# Altium schematic sheet FPGA.SchDoc: MEGAPHONE FPGA
size A3; SheetNumber: 2
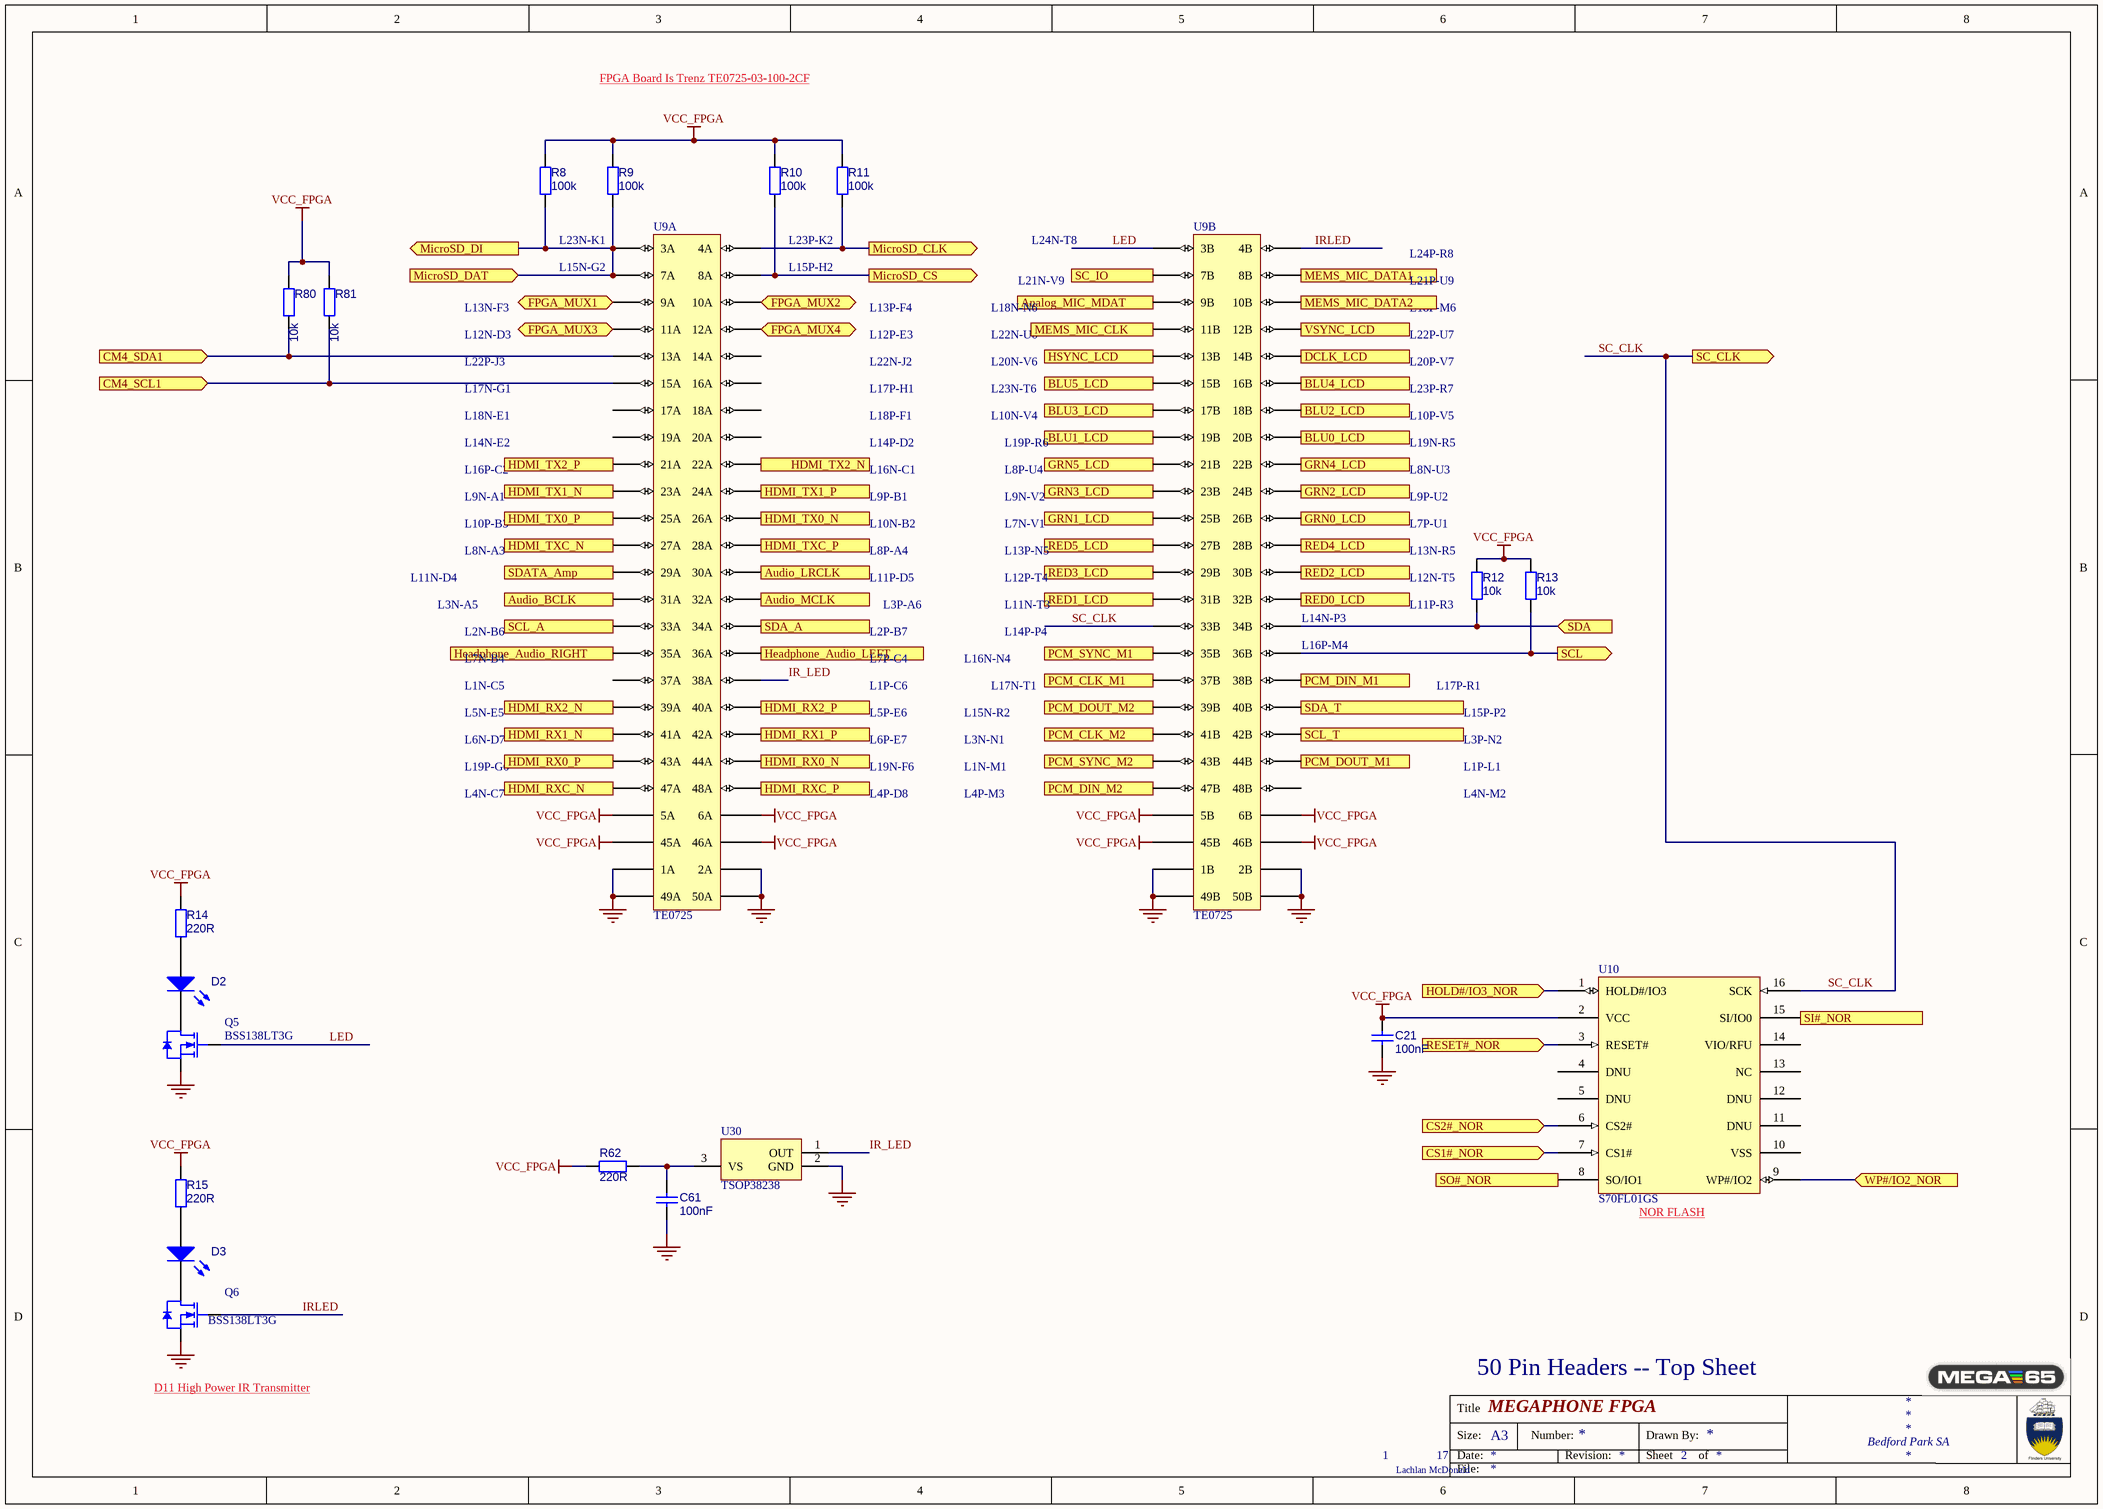
[diagram p0: FPGA.SchDoc]

## Parts
C21  100nF  [0603_CAP UF HD]
C61  100nF  [0603_CAP UF HD]
D2  (no value)  [LED 3mm Red]
D3  (no value)  [LED 3mm Red]
Q5  BSS138LT3G  [SOT-23]
Q6  BSS138LT3G  [SOT-23]
R8  100k  [0603-RESISTOR HD]
R9  100k  [0603-RESISTOR HD]
R10  100k  [0603-RESISTOR HD]
R11  100k  [0603-RESISTOR HD]
R12  10k  [0603-RESISTOR HD]
R13  10k  [0603-RESISTOR HD]
R14  220R  [0603-RESISTOR HD]
R15  220R  [0603-RESISTOR HD]
R62  220R  [0603-RESISTOR HD]
R80  10k  [0603-RESISTOR HD]
R81  10k  [0603-RESISTOR HD]
U9  TE0725  [Trenz TE-0725]  (parts A,B of 2)
U10  S70FL01GS  [S70FL01GS]
U30  TSOP38238  [VISH-TSOP38238]

## Ports
Analog_MIC_MDAT (in), Audio_BCLK (out), Audio_LRCLK (out), Audio_MCLK (out), BLU0_LCD (out), BLU1_LCD (out), BLU2_LCD (out), BLU3_LCD (out), BLU4_LCD (out), BLU5_LCD (out), CM4_SCL1 (in), CM4_SDA1 (in), CS1#_NOR (in), CS2#_NOR (in), DCLK_LCD (out), FPGA_MUX1 (bidir), FPGA_MUX2 (bidir), FPGA_MUX3 (bidir), FPGA_MUX4 (bidir), GRN0_LCD (out), GRN1_LCD (out), GRN2_LCD (out), GRN3_LCD (out), GRN4_LCD (out), GRN5_LCD (out), HDMI_RX0_N (in), HDMI_RX0_P (in), HDMI_RX1_N (in), HDMI_RX1_P (in), HDMI_RX2_N (in), HDMI_RX2_P (in), HDMI_RXC_N (in), HDMI_RXC_P (in), HDMI_TX0_N (out), HDMI_TX0_P (out), HDMI_TX1_N (out), HDMI_TX1_P (out), HDMI_TX2_N (out), HDMI_TX2_P (out), HDMI_TXC_N (out), HDMI_TXC_P (out), Headphone_Audio_LEFT (out), Headphone_Audio_RIGHT (out), HOLD#/IO3_NOR (in), HSYNC_LCD (out), MEMS_MIC_CLK (out), MEMS_MIC_DATA1 (in), MEMS_MIC_DATA2 (in), MicroSD_CLK (out), MicroSD_CS (out), MicroSD_DAT (in), MicroSD_DI (out), PCM_CLK_M1 (out), PCM_CLK_M2 (out), PCM_DIN_M1 (out), PCM_DIN_M2 (out), PCM_DOUT_M1 (in), PCM_DOUT_M2 (in), PCM_SYNC_M1 (in), PCM_SYNC_M2 (in), RED0_LCD (out), RED1_LCD (out), RED2_LCD (out), RED3_LCD (out), RED4_LCD (out), RED5_LCD (out), RESET#_NOR (in), SC_CLK (out), SC_IO (in), SCL (out), SCL_A (out), SCL_T (out), SDA (in), SDA_A (out), SDA_T (in), SDATA_Amp (out), SI#_NOR (in), SO#_NOR (out), VSYNC_LCD (out), WP#/IO2_NOR (in)

## Nets
GND: C21.2 C61.2 Q5.2(S) Q6.2(S) U9.1A U9.1B U9.2A U9.2B U9.49A U9.49B U9.50A U9.50B U30.2(GND)
VCC_FPGA: C21.1 R8.1 R9.1 R10.1 R11.1 R12.1 R13.1 R14.1 R15.1 R62.1 R80.1 R81.1 U9.5A U9.5B U9.6A U9.6B U9.45A U9.45B U9.46A U9.46B U10.2(VCC)
Analog_MIC_MDAT: U9.9B ; port Analog_MIC_MDAT
Audio_BCLK: U9.31A ; port Audio_BCLK
Audio_LRCLK: U9.30A ; port Audio_LRCLK
Audio_MCLK: U9.32A ; port Audio_MCLK
BLU0_LCD: U9.20B ; port BLU0_LCD
BLU1_LCD: U9.19B ; port BLU1_LCD
BLU2_LCD: U9.18B ; port BLU2_LCD
BLU3_LCD: U9.17B ; port BLU3_LCD
BLU4_LCD: U9.16B ; port BLU4_LCD
BLU5_LCD: U9.15B ; port BLU5_LCD
CM4_SCL1: R81.2 U9.15A ; port CM4_SCL1
CM4_SDA1: R80.2 U9.13A ; port CM4_SDA1
CS1#_NOR: U10.7(CS1#) ; port CS1#_NOR
CS2#_NOR: U10.6(CS2#) ; port CS2#_NOR
DCLK_LCD: U9.14B ; port DCLK_LCD
FPGA_MUX1: U9.9A ; port FPGA_MUX1
FPGA_MUX2: U9.10A ; port FPGA_MUX2
FPGA_MUX3: U9.11A ; port FPGA_MUX3
FPGA_MUX4: U9.12A ; port FPGA_MUX4
GRN0_LCD: U9.26B ; port GRN0_LCD
GRN1_LCD: U9.25B ; port GRN1_LCD
GRN2_LCD: U9.24B ; port GRN2_LCD
GRN3_LCD: U9.23B ; port GRN3_LCD
GRN4_LCD: U9.22B ; port GRN4_LCD
GRN5_LCD: U9.21B ; port GRN5_LCD
HDMI_RX0_N: U9.44A ; port HDMI_RX0_N
HDMI_RX0_P: U9.43A ; port HDMI_RX0_P
HDMI_RX1_N: U9.41A ; port HDMI_RX1_N
HDMI_RX1_P: U9.42A ; port HDMI_RX1_P
HDMI_RX2_N: U9.39A ; port HDMI_RX2_N
HDMI_RX2_P: U9.40A ; port HDMI_RX2_P
HDMI_RXC_N: U9.47A ; port HDMI_RXC_N
HDMI_RXC_P: U9.48A ; port HDMI_RXC_P
HDMI_TX0_N: U9.26A ; port HDMI_TX0_N
HDMI_TX0_P: U9.25A ; port HDMI_TX0_P
HDMI_TX1_N: U9.23A ; port HDMI_TX1_N
HDMI_TX1_P: U9.24A ; port HDMI_TX1_P
HDMI_TX2_N: U9.22A ; port HDMI_TX2_N
HDMI_TX2_P: U9.21A ; port HDMI_TX2_P
HDMI_TXC_N: U9.27A ; port HDMI_TXC_N
HDMI_TXC_P: U9.28A ; port HDMI_TXC_P
Headphone_Audio_LEFT: U9.36A ; port Headphone_Audio_LEFT
Headphone_Audio_RIGHT: U9.35A ; port Headphone_Audio_RIGHT
HOLD#/IO3_NOR: U10.1(HOLD#/IO3) ; port HOLD#/IO3_NOR
HSYNC_LCD: U9.13B ; port HSYNC_LCD
IR_LED: U9.38A U30.1(OUT)
IRLED: Q6.1(G) U9.4B
LED: Q5.1(G) U9.3B
MEMS_MIC_CLK: U9.11B ; port MEMS_MIC_CLK
MEMS_MIC_DATA1: U9.8B ; port MEMS_MIC_DATA1
MEMS_MIC_DATA2: U9.10B ; port MEMS_MIC_DATA2
MicroSD_CLK: R11.2 U9.4A ; port MicroSD_CLK
MicroSD_CS: R10.2 U9.8A ; port MicroSD_CS
MicroSD_DAT: R8.2 R9.2 U9.3A U9.7A ; port MicroSD_DAT, port MicroSD_DI
PCM_CLK_M1: U9.37B ; port PCM_CLK_M1
PCM_CLK_M2: U9.41B ; port PCM_CLK_M2
PCM_DIN_M1: U9.38B ; port PCM_DIN_M1
PCM_DIN_M2: U9.47B ; port PCM_DIN_M2
PCM_DOUT_M1: U9.44B ; port PCM_DOUT_M1
PCM_DOUT_M2: U9.39B ; port PCM_DOUT_M2
PCM_SYNC_M1: U9.35B ; port PCM_SYNC_M1
PCM_SYNC_M2: U9.43B ; port PCM_SYNC_M2
RED0_LCD: U9.32B ; port RED0_LCD
RED1_LCD: U9.31B ; port RED1_LCD
RED2_LCD: U9.30B ; port RED2_LCD
RED3_LCD: U9.29B ; port RED3_LCD
RED4_LCD: U9.28B ; port RED4_LCD
RED5_LCD: U9.27B ; port RED5_LCD
RESET#_NOR: U10.3(RESET#) ; port RESET#_NOR
SC_CLK: U9.33B U10.16(SCK) ; port SC_CLK
SC_IO: U9.7B ; port SC_IO
SCL: R13.2 U9.36B ; port SCL
SCL_A: U9.33A ; port SCL_A
SCL_T: U9.42B ; port SCL_T
SDA: R12.2 U9.34B ; port SDA
SDA_A: U9.34A ; port SDA_A
SDA_T: U9.40B ; port SDA_T
SDATA_Amp: U9.29A ; port SDATA_Amp
SI#_NOR: U10.15(SI/IO0) ; port SI#_NOR
SO#_NOR: U10.8(SO/IO1) ; port SO#_NOR
VSYNC_LCD: U9.12B ; port VSYNC_LCD
WP#/IO2_NOR: U10.9(WP#/IO2) ; port WP#/IO2_NOR
NetC61_1: C61.1 R62.2 U30.3(VS)
NetD2_A: D2.A R14.2
NetD2_K: D2.K Q5.3(D)
NetD3_A: D3.A R15.2
NetD3_K: D3.K Q6.3(D)

Not connected (* = marked no-connect by the designer): U9 14A 16A 17A 18A 19A 20A 37A 48B; U10 4(DNU) 5(DNU) 10(VSS) 11(DNU) 12(DNU) 13(NC) 14(VIO/RFU)

## Notes on the sheet
- FPGA Board Is Trenz TE0725-03-100-2CF
- L23N-K1
- L23P-K2
- L24N-T8
- L13N-F3
- L15N-G2
- L15P-H2
- L13P-F4
- L18N-N6
- L21N-V9
- L24P-R8
- L21P-U9
- L18P-M6
- L12N-D3
- L22P-J3
- L12P-E3
- L22N-J2
- L22N-U6
- L20N-V6
- L22P-U7
- L20P-V7
- L17N-G1
- L18N-E1
- L14N-E2
- L17P-H1
- L18P-F1
- L14P-D2
- L23N-T6
- L10N-V4
- L19P-R6
- L23P-R7
- L10P-V5
- L19N-R5
- L16P-C2
- L9N-A1
- L16N-C1
- L9P-B1
- L8P-U4
- L9N-V2
- L8N-U3
- L9P-U2
- L11N-D4
- L10P-B3
- L8N-A3
- L10N-B2
- L8P-A4
- L11P-D5
- L7N-V1
- L13P-N5
- L12P-T4
- (near R12) L7P-U1
- (near R12) L13N-R5
- (near R12) L12N-T5
- L3N-A5
- L2N-B6
- L2P-B7
- L3P-A6
- L11N-T3
- L14P-P4
- (near U9) L14N-P3
- (near U9) L16P-M4
- (near R12) L11P-R3
- L7N-B4
- L1N-C5
- L5N-E5
- L7P-C4
- L1P-C6
- L5P-E6
- L16N-N4
- L15N-R2
- L17N-T1
- L17P-R1
- L15P-P2
- L6N-D7
- L19P-G6
- L6P-E7
- L19N-F6
- L3N-N1
- L1N-M1
- L3P-N2
- L1P-L1
- L4N-C7
- L4P-D8
- L4P-M3
- L4N-M2
- (near U10) NOR FLASH
- D11 High Power IR Transmitter
- 50 Pin Headers -- Top Sheet
- 1
- 17
- Lachlan McDonald
- Title
- Size:
- Date:
- A3
- Number:
- Revision:
- Sheet
- Drawn By:
- of
- Bedford Park SA
- File:

## Library data of the parts
C21 C61 = Cap: Capacitor; Value: 100nF
D2 D3 = LED: Manufacturer: *; Element 14 Part Number: *
Q5 Q6 = BSS138LT3G: Power MOSFET, 200 mA, 50 V, N-Channel, 3-Pin SOT-23, Pb-Free, Tape and Reel; Manufacturer: On Semiconductor; Element 14 Part Number: 1431319; Manufacturer Number: BSS138LT3G; Digikey Number: BSS138LT3GOSCT-ND
R8-R15 R62 R80 R81 = Resistor
  R8-R11: Value: 100k
  R12 R13 R80 R81: Value: 10k
  R14 R15 R62: Value: 220R
U9 = TRENZ TE0725: FPGA Module Xilinx Artix-7 100T, optical transceiver; Manufacturer: TE Connectivity; Manufacturer Number: 7-534206-5; Digikey Number: A32951-ND
U10 = NOR Flash: Manufacturer: S70FL01GSDPMFI010; Manufacturer Number: S70FL01GS; Digikey Number: S70FL01GSDPMFI010-ND
U30 = CMP-1666-00022-1: IR Receiver Modules for Remote Control System, 2.5 to 5.5 V, -25 to 85 degC, 3-Pin THD, RoHS, Bulk; Tolerance: 30ppm; ESR: 40 Ohm; Capacitance: 1.8E-11 f; Frequency: 24 MHz; Load Capacitance: 18 pF; DatasheetVersion: Rev. 1.5, 07/2016; REACH SVHC: No SVHC; Frequency Tolerance: 30ppm; ComponentLink2URL: http://www.vishay.com/docs/82491/tsop382.pdf; Mount: Surface Mount; Length: 0.197 inch; Min Operating Temperature: -20degC; Packaging: Tape and Reel; ComponentLink1URL: http://www.vishay.com/; Width: 0.126 inch; Height: 0.041 inch; PackageDescription: 3-Pin Through Hole Device, Body 5.00 x 4.80 mm, Pitch 2.54 mm; Max Operating Temperature: 70degC; Pins: 4; RoHSCompliant: True; Package Quantity: 1000; PackageReference: VISH-TSOP38238; ComponentLink2Description: Datasheet; ComponentLink1Description: Manufacturer URL; Resistance: 40 Ohm